# Altium schematic sheet 3_W5500Net.SchDoc
size A4
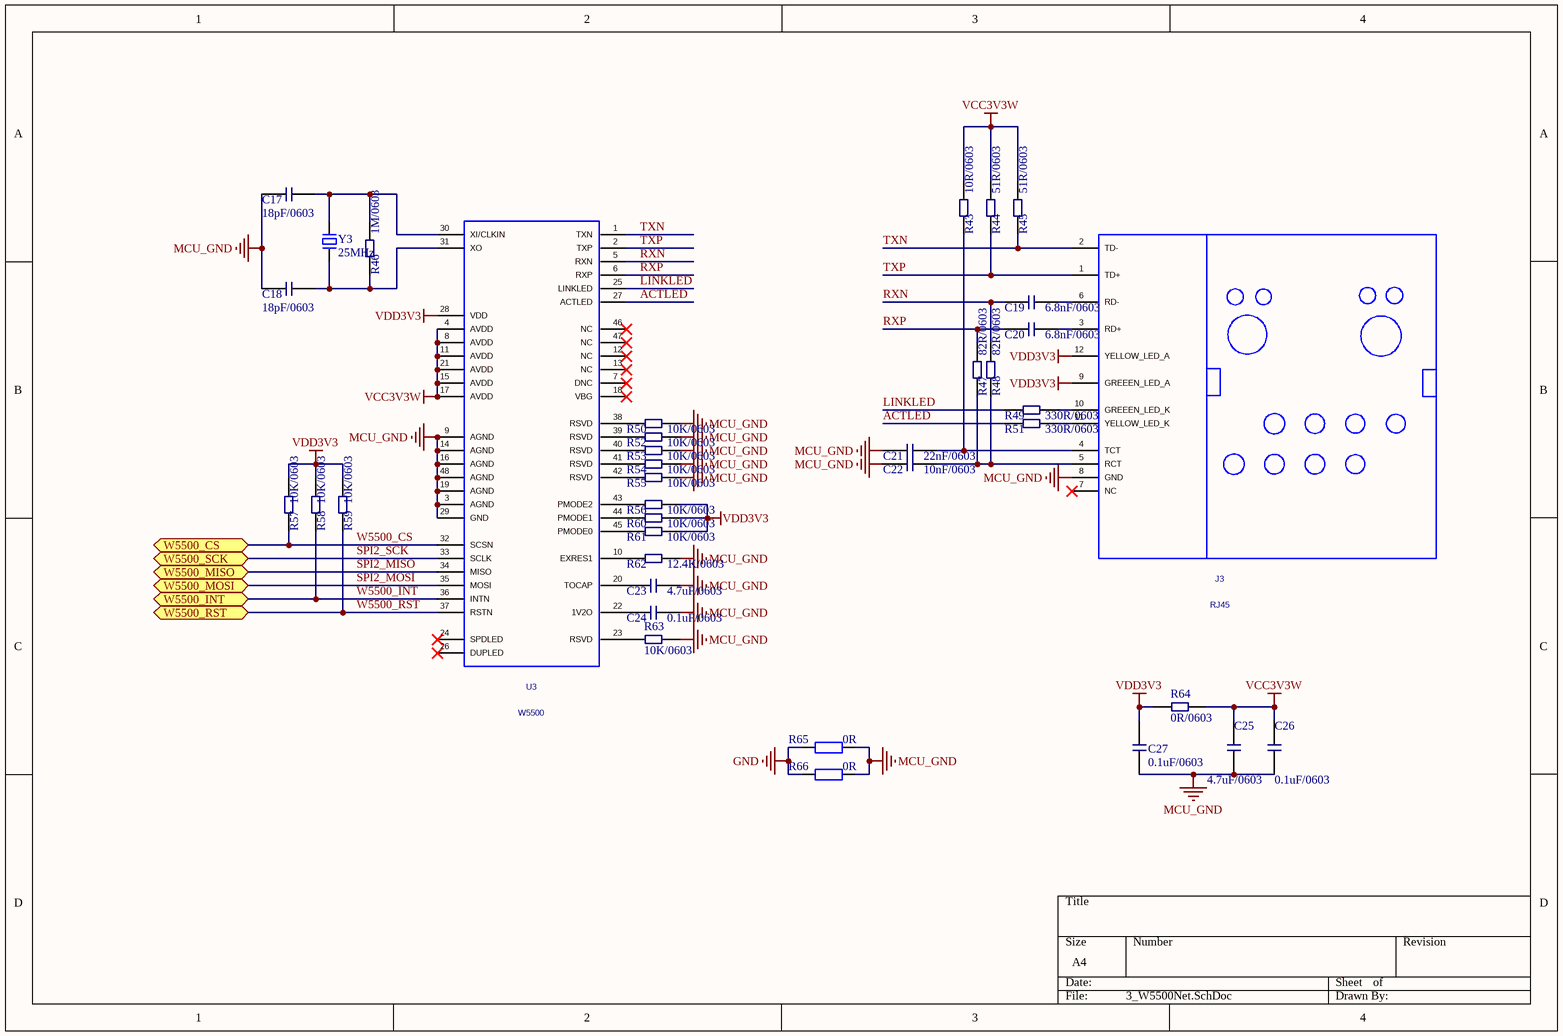
[diagram p0: 3_W5500Net.SchDoc]

## Parts
C17  18pF/0603  [LC-0603_C]
C18  18pF/0603  [LC-0603_C]
C19  6.8nF/0603  [LC-0603_C]
C20  6.8nF/0603  [LC-0603_C]
C21  22nF/0603  [LC-0603_C]
C22  10nF/0603  [LC-0603_C]
C23  4.7uF/0603  [LC-0603_C]
C24  0.1uF/0603  [LC-0603_C]
C25  4.7uF/0603  [LC-0603_C]
C26  0.1uF/0603  [LC-0603_C]
C27  0.1uF/0603  [LC-0603_C]
J3  RJ45  [RJ-45A12]
R43  10R/0603  [LC-0603_R]
R44  51R/0603  [LC-0603_R]
R45  51R/0603  [LC-0603_R]
R46  1M/0603  [LC-0603_R]
R47  82R/0603  [LC-0603_R]
R48  82R/0603  [LC-0603_R]
R49  330R/0603  [LC-0603_R]
R50  10K/0603  [LC-0603_R]
R51  330R/0603  [LC-0603_R]
R52  10K/0603  [LC-0603_R]
R53  10K/0603  [LC-0603_R]
R54  10K/0603  [LC-0603_R]
R55  10K/0603  [LC-0603_R]
R56  10K/0603  [LC-0603_R]
R57  10K/0603  [LC-0603_R]
R58  10K/0603  [LC-0603_R]
R59  10K/0603  [LC-0603_R]
R60  10K/0603  [LC-0603_R]
R61  10K/0603  [LC-0603_R]
R62  12.4K/0603  [LC-0603_R]
R63  10K/0603  [LC-0603_R]
R64  0R/0603  [LC-0603_R]
R65  0R  [LC-0603_R]
R66  0R  [LC-0603_R]
U3  W5500  [LQFP48-7*7]
Y3  25MHz  [OSC HC-49S]

## Ports
W5500_CS, W5500_INT, W5500_MISO, W5500_MOSI, W5500_RST, W5500_SCK

## Nets
GND: R65.2 R66.2
MCU_GND: C17.1 C18.1 C21.1 C22.1 C23.2 C24.2 C25.1 C26.1 C27.1 J3.8(GND) R50.1 R52.1 R53.1 R54.1 R55.1 R62.2 R63.1 R65.1 R66.1 U3.3(AGND) U3.9(AGND) U3.14(AGND) U3.16(AGND) U3.19(AGND) U3.29(GND) U3.48(AGND)
VCC3V3W: C25.2 C26.2 R43.2 R44.2 R45.2 R64.2 U3.4(AVDD) U3.8(AVDD) U3.11(AVDD) U3.15(AVDD) U3.17(AVDD) U3.21(AVDD)
VDD3V3: C27.2 J3.9(GREEEN_LED_A) J3.12(YELLOW_LED_A) R56.1 R57.1 R58.1 R59.1 R60.1 R61.1 R64.1 U3.28(VDD)
ACTLED: R51.1 U3.27(ACTLED)
LINKLED: R49.1 U3.25(LINKLED)
RXN: C19.1 R48.2 U3.5(RXN)
RXP: C20.1 R47.2 U3.6(RXP)
SPI2_MISO: U3.34(MISO) ; port W5500_MISO
SPI2_MOSI: U3.35(MOSI) ; port W5500_MOSI
SPI2_SCK: U3.33(SCLK) ; port W5500_SCK
TXN: J3.2(TD-) R45.1 U3.1(TXN)
TXP: J3.1(TD+) R44.1 U3.2(TXP)
W5500_CS: R57.2 U3.32(SCSN) ; port W5500_CS
W5500_INT: R58.2 U3.36(INTN) ; port W5500_INT
W5500_RST: R59.2 U3.37(RSTN) ; port W5500_RST
NetC17_2: C17.2 R46.2 U3.30(XI/CLKIN) Y3.2
NetC18_2: C18.2 R46.1 U3.31(XO) Y3.1
NetC19_2: C19.2 J3.6(RD-)
NetC20_2: C20.2 J3.3(RD+)
NetC21_2: C21.2 J3.4(TCT) R43.1
NetC22_2: C22.2 J3.5(RCT) R47.1 R48.1
NetC23_1: C23.1 U3.20(TOCAP)
NetC24_1: C24.1 U3.22(1V2O)
NetJ3_10: J3.10(GREEEN_LED_K) R49.2
NetJ3_11: J3.11(YELLOW_LED_K) R51.2
NetR50_2: R50.2 U3.38(RSVD)
NetR52_2: R52.2 U3.39(RSVD)
NetR53_2: R53.2 U3.40(RSVD)
NetR54_2: R54.2 U3.41(RSVD)
NetR55_2: R55.2 U3.42(RSVD)
NetR56_2: R56.2 U3.43(PMODE2)
NetR60_2: R60.2 U3.44(PMODE1)
NetR61_2: R61.2 U3.45(PMODE0)
NetR62_1: R62.1 U3.10(EXRES1)
NetR63_2: R63.2 U3.23(RSVD)

Not connected (* = marked no-connect by the designer): J3 7(NC)*; U3 7(DNC)* 12(NC)* 13(NC)* 18(VBG)* 24(SPDLED)* 26(DUPLED)* 46(NC)* 47(NC)*

## Library data of the parts
C17-C27 = CAP-0603
R43-R64 = RES-0603
R65 R66 = Res1: 贴片电阻; Value: 1K; Published: 8-Jun-2000; LatestRevisionDate: 17-Jul-2002; LatestRevisionNote: Re-released for DXP Platform.; PackageReference: AXIAL-0.4; Publisher: Altium Limited
Y3 = XTAL-2P: 2脚无源脚晶振; 版权归属: 源创客; BOM名称: 2脚无源脚晶振; 学习资源: www.ooocke.com
J3 = RJ45: PCB DECAL: RJ45
U3 = W5500: PCB DECAL: W5500